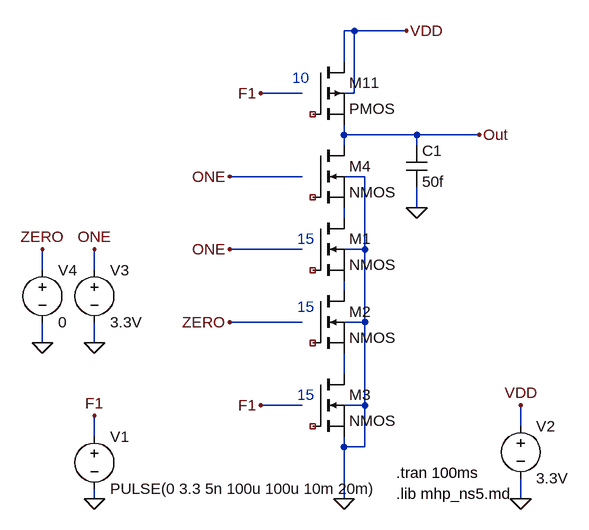
[diagram p0: schematic pe_nand_charge_sharing.asc]
pe_nand_charge_sharing.asc, the LTspice schematic file:
Version 4
SHEET 1 1292 680
WIRE -1472 -672 -1488 -672
WIRE -1392 -672 -1472 -672
WIRE -1488 -624 -1488 -672
WIRE -1552 -576 -1616 -576
WIRE -1472 -576 -1472 -672
WIRE -1472 -576 -1488 -576
WIRE -1488 -512 -1488 -528
WIRE -1376 -512 -1488 -512
WIRE -1280 -512 -1376 -512
WIRE -1488 -496 -1488 -512
WIRE -1376 -496 -1376 -512
WIRE -1552 -448 -1664 -448
WIRE -1456 -448 -1488 -448
WIRE -1376 -400 -1376 -432
WIRE -1488 -384 -1488 -400
WIRE -1552 -336 -1664 -336
WIRE -1456 -336 -1456 -448
WIRE -1456 -336 -1488 -336
WIRE -1952 -304 -1952 -336
WIRE -1872 -304 -1872 -336
WIRE -1488 -272 -1488 -288
WIRE -1552 -224 -1664 -224
WIRE -1456 -224 -1456 -336
WIRE -1456 -224 -1488 -224
WIRE -1952 -192 -1952 -224
WIRE -1872 -192 -1872 -224
WIRE -1488 -144 -1488 -176
WIRE -1552 -96 -1616 -96
WIRE -1456 -96 -1456 -224
WIRE -1456 -96 -1488 -96
WIRE -1216 -64 -1216 -96
WIRE -1872 -48 -1872 -80
WIRE -1488 -32 -1488 -48
WIRE -1456 -32 -1456 -96
WIRE -1456 -32 -1488 -32
WIRE -1872 48 -1872 32
WIRE -1488 48 -1488 -32
WIRE -1216 48 -1216 16
FLAG -1488 48 0
FLAG -1616 -96 F1
FLAG -1216 48 0
FLAG -1872 48 0
FLAG -1216 -96 VDD
FLAG -1872 -80 F1
FLAG -1280 -512 Out
FLAG -1392 -672 VDD
FLAG -1872 -192 0
FLAG -1872 -336 ONE
FLAG -1664 -336 ONE
FLAG -1664 -224 ZERO
FLAG -1616 -576 F1
FLAG -1664 -448 ONE
FLAG -1952 -192 0
FLAG -1952 -336 ZERO
FLAG -1376 -400 0
SYMBOL pmos -1536 -624 R0
SYMATTR InstName M11
SYMATTR Value2 l=0.6u w=3u
SYMBOL voltage -1872 -64 R0
WINDOW 123 0 0 Left 0
WINDOW 39 0 0 Left 0
SYMATTR InstName V1
SYMATTR Value PULSE(0 3.3 5n 100u 100u 10m 20m)
SYMBOL voltage -1216 -80 R0
WINDOW 123 0 0 Left 0
WINDOW 39 0 0 Left 0
SYMATTR InstName V2
SYMATTR Value 3.3V
SYMBOL nmos -1536 -384 R0
SYMATTR InstName M1
SYMATTR SpiceModel ""
SYMATTR Value NMOS
SYMATTR Value2 l=0.6u w=4.5u
SYMBOL voltage -1872 -320 R0
WINDOW 123 0 0 Left 0
WINDOW 39 0 0 Left 0
SYMATTR InstName V3
SYMATTR Value 3.3V
SYMBOL nmos -1536 -272 R0
SYMATTR InstName M2
SYMATTR SpiceModel ""
SYMATTR Value NMOS
SYMATTR Value2 l=0.6u w=4.5u
SYMBOL nmos -1536 -144 R0
SYMATTR InstName M3
SYMATTR SpiceModel ""
SYMATTR Value NMOS
SYMATTR Value2 l=0.6u w=4.5u
SYMBOL nmos -1536 -496 R0
SYMATTR InstName M4
SYMATTR SpiceModel ""
SYMATTR Value NMOS
SYMATTR Value2 l=0.6u w=4.5u
SYMBOL voltage -1952 -320 R0
WINDOW 123 0 0 Left 0
WINDOW 39 0 0 Left 0
SYMATTR InstName V4
SYMATTR Value 0
SYMBOL cap -1392 -496 R0
SYMATTR InstName C1
SYMATTR Value 50f
TEXT -1568 -600 Left 0 ;10
TEXT -1408 40 Left 0 !.lib mhp_ns5.md
TEXT -1408 8 Left 0 !.tran 100ms
TEXT -1560 -352 Left 0 ;15
TEXT -1560 -248 Left 0 ;15
TEXT -1560 -112 Left 0 ;15

The netlist it stands for:
* pe_nand_charge_sharing.asc
* M11: PMOS l=0.6u w=3u (symbol pmos not certain, pin order unknown); nets seen at it: Out, VDD
V1 F1 0 PULSE(0 3.3 5n 100u 100u 10m 20m)
V2 VDD 0 3.3V
* M1: NMOS l=0.6u w=4.5u (symbol nmos not certain, pin order unknown); nets seen at it: N001, N002
V3 ONE 0 3.3V
* M2: NMOS l=0.6u w=4.5u (symbol nmos not certain, pin order unknown); nets seen at it: N002, N003
* M3: NMOS l=0.6u w=4.5u (symbol nmos not certain, pin order unknown); nets seen at it: 0, N003
* M4: NMOS l=0.6u w=4.5u (symbol nmos not certain, pin order unknown); nets seen at it: N001, Out
V4 ZERO 0 0
C1 Out 0 50f
* 10
.lib mhp_ns5.md
.tran 100ms
* 15
* 15
* 15
.backanno
.end